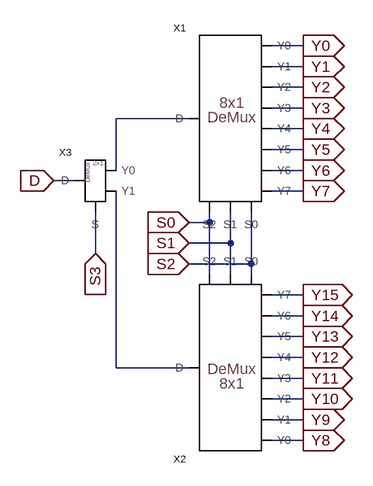
[diagram p0: schematic 16OutputDeMux.asc]
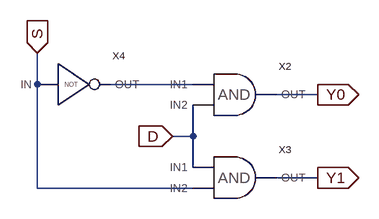
[diagram p1: sub-circuit 2outputdemux.asc]
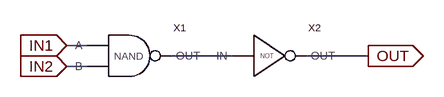
[diagram p2: sub-circuit and.asc]
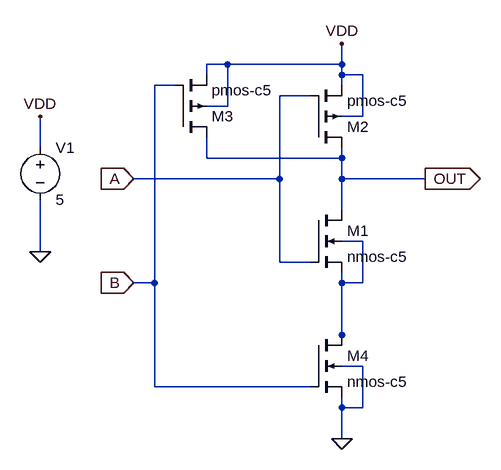
[diagram p3: sub-circuit nand.asc]
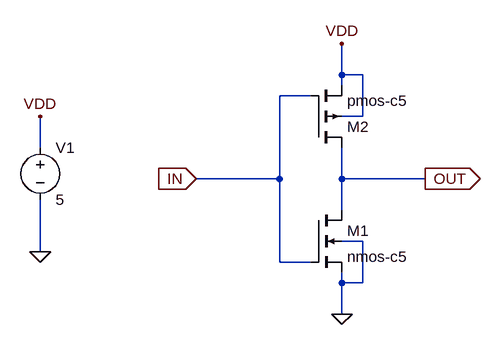
[diagram p4: sub-circuit inverter.asc]
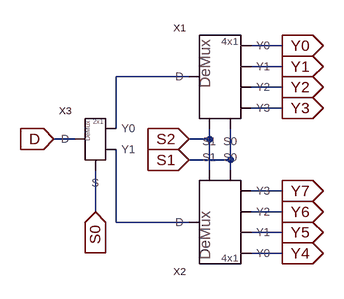
[diagram p5: sub-circuit 8outputdemux.asc]
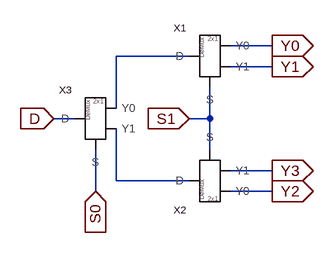
[diagram p6: sub-circuit 4outputdemux.asc]
16OutputDeMux.asc, the LTspice schematic file:
Version 4
SHEET 1 880 680
WIRE 224 -64 176 -64
WIRE 224 -32 176 -32
WIRE 224 0 176 0
WIRE 224 32 176 32
WIRE 48 48 -64 48
WIRE 224 64 176 64
WIRE 224 96 176 96
WIRE -64 128 -64 48
WIRE 224 128 176 128
WIRE -128 144 -160 144
WIRE 224 160 176 160
WIRE 80 208 80 192
WIRE 80 208 48 208
WIRE 112 240 112 192
WIRE 112 240 48 240
WIRE -96 256 -96 192
WIRE 144 272 144 192
WIRE 144 272 48 272
WIRE 80 288 80 208
WIRE 112 288 112 240
WIRE 144 288 144 272
WIRE 224 320 176 320
WIRE 224 352 176 352
WIRE 224 384 176 384
WIRE 224 416 176 416
WIRE -64 432 -64 160
WIRE 48 432 -64 432
WIRE 224 448 176 448
WIRE 224 480 176 480
WIRE 224 512 176 512
WIRE 224 544 176 544
FLAG -160 144 D
IOPIN -160 144 In
FLAG -96 256 S3
IOPIN -96 256 In
FLAG 48 240 S1
IOPIN 48 240 In
FLAG 224 -64 Y0
IOPIN 224 -64 Out
FLAG 224 -32 Y1
IOPIN 224 -32 Out
FLAG 224 32 Y3
IOPIN 224 32 Out
FLAG 224 0 Y2
IOPIN 224 0 Out
FLAG 48 272 S2
IOPIN 48 272 In
FLAG 224 160 Y7
IOPIN 224 160 Out
FLAG 224 128 Y6
IOPIN 224 128 Out
FLAG 224 64 Y4
IOPIN 224 64 Out
FLAG 224 96 Y5
IOPIN 224 96 Out
FLAG 48 208 S0
IOPIN 48 208 In
FLAG 224 320 Y15
IOPIN 224 320 Out
FLAG 224 352 Y14
IOPIN 224 352 Out
FLAG 224 416 Y12
IOPIN 224 416 Out
FLAG 224 384 Y13
IOPIN 224 384 Out
FLAG 224 544 Y8
IOPIN 224 544 Out
FLAG 224 512 Y9
IOPIN 224 512 Out
FLAG 224 448 Y11
IOPIN 224 448 Out
FLAG 224 480 Y10
IOPIN 224 480 Out
SYMBOL 2OutputDeMux -96 144 M0
SYMATTR InstName X3
SYMBOL 8OutputDeMux 160 -80 M0
SYMATTR InstName X1
SYMBOL 8OutputDeMux 160 560 R180
SYMATTR InstName X2

2outputdemux.asc, the sub-circuit schematic file:
Version 4
SHEET 1 880 680
WIRE -128 80 -128 32
WIRE 112 80 -16 80
WIRE 304 96 240 96
WIRE 112 160 112 112
WIRE 112 160 80 160
WIRE 112 208 112 160
WIRE 304 224 240 224
WIRE -128 240 -128 80
WIRE 112 240 -128 240
FLAG -128 32 S
IOPIN -128 32 In
FLAG 304 96 Y0
IOPIN 304 96 Out
FLAG 304 224 Y1
IOPIN 304 224 Out
FLAG 80 160 D
IOPIN 80 160 In
SYMBOL AND 176 96 R0
SYMATTR InstName X2
SYMBOL AND 176 224 R0
SYMATTR InstName X3
SYMBOL Inverter -80 80 R0
SYMATTR InstName X4

and.asc, the sub-circuit schematic file:
Version 4
SHEET 1 880 680
WIRE 80 128 48 128
WIRE 304 144 208 144
WIRE 512 144 416 144
WIRE 80 160 48 160
FLAG 512 144 OUT
IOPIN 512 144 Out
FLAG 48 128 IN1
IOPIN 48 128 In
FLAG 48 160 IN2
IOPIN 48 160 In
SYMBOL NAND 144 144 R0
SYMATTR InstName X1
SYMBOL Inverter 352 144 R0
SYMATTR InstName X2

nand.asc, the sub-circuit schematic file:
Version 4
SHEET 1 880 688
WIRE 320 96 288 96
WIRE 496 96 496 64
WIRE 496 96 320 96
WIRE 288 112 288 96
WIRE 496 112 496 96
WIRE 528 112 496 112
WIRE 240 128 208 128
WIRE 496 128 496 112
WIRE 448 144 400 144
WIRE 320 160 320 96
WIRE 320 160 288 160
WIRE 528 176 528 112
WIRE 528 176 496 176
WIRE 32 224 32 176
WIRE 288 240 288 208
WIRE 496 240 496 224
WIRE 496 240 288 240
WIRE 400 272 400 144
WIRE 400 272 176 272
WIRE 496 272 496 240
WIRE 624 272 496 272
WIRE 496 320 496 272
WIRE 528 368 496 368
WIRE 32 384 32 304
WIRE 400 400 400 272
WIRE 448 400 400 400
WIRE 208 432 208 128
WIRE 208 432 176 432
WIRE 496 432 496 416
WIRE 528 432 528 368
WIRE 528 432 496 432
WIRE 496 512 496 432
WIRE 496 528 496 512
WIRE 528 560 496 560
WIRE 208 592 208 432
WIRE 448 592 208 592
WIRE 496 624 496 608
WIRE 528 624 528 560
WIRE 528 624 496 624
WIRE 496 672 496 624
FLAG 496 64 VDD
FLAG 624 272 OUT
IOPIN 624 272 Out
FLAG 32 384 0
FLAG 32 176 VDD
FLAG 496 672 0
FLAG 176 272 A
IOPIN 176 272 In
FLAG 176 432 B
IOPIN 176 432 In
SYMBOL nmos4 448 320 R0
SYMATTR InstName M1
SYMATTR Value nmos-c5
SYMATTR Value2 l=1u w=1u
SYMBOL pmos4 448 224 M180
SYMATTR InstName M2
SYMATTR Value pmos-c5
SYMATTR Value2 l=1u w=1.5u
SYMBOL voltage 32 208 R0
SYMATTR InstName V1
SYMATTR Value 5
SYMBOL pmos4 240 208 M180
SYMATTR InstName M3
SYMATTR Value pmos-c5
SYMATTR Value2 l=1u w=1.5u
SYMBOL nmos4 448 512 R0
SYMATTR InstName M4
SYMATTR Value nmos-c5
SYMATTR Value2 l=1u w=1u

inverter.asc, the sub-circuit schematic file:
Version 4
SHEET 1 880 680
WIRE 496 112 496 64
WIRE 528 112 496 112
WIRE 496 128 496 112
WIRE 448 144 400 144
WIRE 528 176 528 112
WIRE 528 176 496 176
WIRE 32 224 32 176
WIRE 400 272 400 144
WIRE 400 272 272 272
WIRE 496 272 496 224
WIRE 624 272 496 272
WIRE 496 320 496 272
WIRE 528 368 496 368
WIRE 32 384 32 304
WIRE 400 400 400 272
WIRE 448 400 400 400
WIRE 496 432 496 416
WIRE 528 432 528 368
WIRE 528 432 496 432
WIRE 496 480 496 432
FLAG 496 480 0
FLAG 496 64 VDD
FLAG 624 272 OUT
IOPIN 624 272 Out
FLAG 272 272 IN
IOPIN 272 272 In
FLAG 32 384 0
FLAG 32 176 VDD
SYMBOL nmos4 448 320 R0
SYMATTR InstName M1
SYMATTR Value nmos-c5
SYMATTR Value2 l=1u w=1u
SYMBOL pmos4 448 224 M180
SYMATTR InstName M2
SYMATTR Value pmos-c5
SYMATTR Value2 l=1u w=1.5u
SYMBOL voltage 32 208 R0
SYMATTR InstName V1
SYMATTR Value 5

8outputdemux.asc, the sub-circuit schematic file:
Version 4
SHEET 1 880 680
WIRE 192 0 144 0
WIRE 192 32 144 32
WIRE 48 48 -64 48
WIRE 192 64 144 64
WIRE 192 96 144 96
WIRE -64 128 -64 48
WIRE -128 144 -160 144
WIRE 80 144 80 128
WIRE 80 144 48 144
WIRE 112 176 112 128
WIRE 112 176 48 176
WIRE 80 192 80 144
WIRE 112 192 112 176
WIRE 192 224 144 224
WIRE -96 256 -96 192
WIRE 192 256 144 256
WIRE -64 272 -64 160
WIRE 48 272 -64 272
WIRE 192 288 144 288
WIRE 192 320 144 320
FLAG -160 144 D
IOPIN -160 144 In
FLAG -96 256 S0
IOPIN -96 256 In
FLAG 48 144 S2
IOPIN 48 144 In
FLAG 192 0 Y0
IOPIN 192 0 Out
FLAG 192 32 Y1
IOPIN 192 32 Out
FLAG 192 96 Y3
IOPIN 192 96 Out
FLAG 192 64 Y2
IOPIN 192 64 Out
FLAG 48 176 S1
IOPIN 48 176 In
FLAG 192 224 Y7
IOPIN 192 224 Out
FLAG 192 256 Y6
IOPIN 192 256 Out
FLAG 192 320 Y4
IOPIN 192 320 Out
FLAG 192 288 Y5
IOPIN 192 288 Out
SYMBOL 2OutputDeMux -96 144 M0
SYMATTR InstName X3
SYMBOL 4OutputDeMux 128 48 M0
SYMATTR InstName X1
SYMBOL 4OutputDeMux 128 272 R180
SYMATTR InstName X2

4outputdemux.asc, the sub-circuit schematic file:
Version 4
SHEET 1 880 680
WIRE 176 32 112 32
WIRE 48 48 -64 48
WIRE 176 64 112 64
WIRE -64 128 -64 48
WIRE -128 144 -160 144
WIRE 80 144 80 96
WIRE 80 144 48 144
WIRE 80 192 80 144
WIRE 176 224 112 224
WIRE -64 240 -64 160
WIRE 48 240 -64 240
WIRE -96 256 -96 192
WIRE 176 256 112 256
FLAG -160 144 D
IOPIN -160 144 In
FLAG -96 256 S0
IOPIN -96 256 In
FLAG 48 144 S1
IOPIN 48 144 In
FLAG 176 32 Y0
IOPIN 176 32 Out
FLAG 176 64 Y1
IOPIN 176 64 Out
FLAG 176 224 Y3
IOPIN 176 224 Out
FLAG 176 256 Y2
IOPIN 176 256 Out
SYMBOL 2OutputDeMux 80 48 M0
SYMATTR InstName X1
SYMBOL 2OutputDeMux 80 240 R180
SYMATTR InstName X2
SYMBOL 2OutputDeMux -96 144 M0
SYMATTR InstName X3

The netlist it stands for:
* 16OutputDeMux.asc
XX3 N001 N002 S3 D 2outputdemux
XX1 Y0 Y1 Y2 Y3 Y4 Y5 Y6 Y7 S2 S1 S0 N001 8outputdemux
XX2 Y8 Y9 Y10 Y11 Y12 Y13 Y14 Y15 S2 S1 S0 N002 8outputdemux

* block symbol definitions
.subckt 2outputdemux Y0 Y1 S D
XX2 N001 D Y0 and
XX3 D S Y1 and
XX4 S N001 inverter
.ends 2outputdemux

.subckt and IN1 IN2 OUT
XX1 IN1 IN2 N001 nand
XX2 N001 OUT inverter
.ends and

.subckt nand A B OUT
M1 OUT A N001 N001 nmos-c5 l=1u w=1u
M2 OUT A VDD VDD pmos-c5 l=1u w=1.5u
V1 VDD 0 5
M3 OUT B VDD VDD pmos-c5 l=1u w=1.5u
M4 N001 B 0 0 nmos-c5 l=1u w=1u
.ends nand

.subckt inverter IN OUT
M1 OUT IN 0 0 nmos-c5 l=1u w=1u
M2 OUT IN VDD VDD pmos-c5 l=1u w=1.5u
V1 VDD 0 5
.ends inverter

.subckt 8outputdemux Y0 Y1 Y2 Y3 Y4 Y5 Y6 Y7 S0 S1 S2 D
XX3 N001 N002 S0 D 2outputdemux
XX1 Y0 Y1 Y2 Y3 S1 S2 N001 4outputdemux
XX2 Y4 Y5 Y6 Y7 S1 S2 N002 4outputdemux
.ends 8outputdemux

.subckt 4outputdemux Y0 Y1 Y2 Y3 S0 S1 D
XX1 Y0 Y1 S1 N001 2outputdemux
XX2 Y2 Y3 S1 N002 2outputdemux
XX3 N001 N002 S0 D 2outputdemux
.ends 4outputdemux

.model NMOS NMOS
.model PMOS PMOS
.lib standard.mos
.backanno
.end